# Altium schematic sheet top_level.SchDoc
size 431 x 279 mm; SheetNumber: 1; SheetTotal: 2; ENG_APP_DATE: --/--/--; DSN_APP_DATE: --/--/--; CHK_APP_DATE: --/--/--
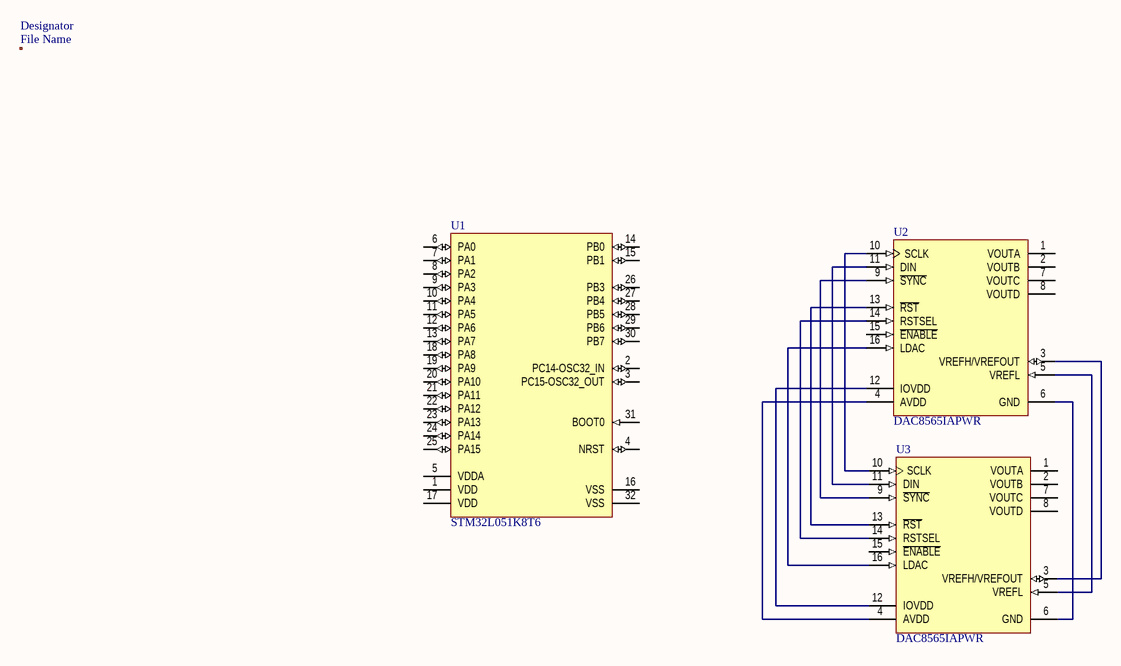
[diagram p0: top_level.SchDoc]

## Parts
U1  STM32L051K8T6  [STM-LQFP32_L]
U2  DAC8565IAPWR  [TI-PW16_L]
U3  DAC8565IAPWR  [TI-PW16_L]

## Sub-sheets
Designator = File Name: no entries

## Nets
NetU2_3: U2.3(VREFH/VREFOUT) U3.3(VREFH/VREFOUT)
NetU2_4: U2.4(AVDD) U3.4(AVDD)
NetU2_5: U2.5(VREFL) U3.5(VREFL)
NetU2_6: U2.6(GND) U3.6(GND)
NetU2_9: U2.9(~{SYNC}) U3.9(~{SYNC})
NetU2_10: U2.10(SCLK) U3.10(SCLK)
NetU2_11: U2.11(DIN) U3.11(DIN)
NetU2_12: U2.12(IOVDD) U3.12(IOVDD)
NetU2_13: U2.13(~{RST}) U3.13(~{RST})
NetU2_14: U2.14(RSTSEL) U3.14(RSTSEL)
NetU2_16: U2.16(LDAC) U3.16(LDAC)

Not connected (* = marked no-connect by the designer): U1 1(VDD) 2(PC14-OSC32_IN) 3(PC15-OSC32_OUT) 4(NRST) 5(VDDA) 6(PA0) 7(PA1) 8(PA2) 9(PA3) 10(PA4) 11(PA5) 12(PA6) 13(PA7) 14(PB0) 15(PB1) 16(VSS) 17(VDD) 18(PA8) 19(PA9) 20(PA10) 21(PA11) 22(PA12) 23(PA13) 24(PA14) 25(PA15) 26(PB3) 27(PB4) 28(PB5) 29(PB6) 30(PB7) 31(BOOT0) 32(VSS); U2 1(VOUTA) 2(VOUTB) 7(VOUTC) 8(VOUTD) 15(~{ENABLE}); U3 1(VOUTA) 2(VOUTB) 7(VOUTC) 8(VOUTD) 15(~{ENABLE})

## Notes on the sheet
- 8
- 7
- 6
- 5
- 4
- 3
- DWG. NO.
- REV.
- SHT.
- 2
- 1
- THIS DOCUMENT AND THE DATA DISCLOSED HEREIN OR HEREWITH IS THE PROPERTY OF ALTIUM LIMITED AND MAY BE FREELY DISTRIBUTED IN WHOLE. NO RIGHTS ARE RESERVED OR EXPRESS OR IMPLIED WARANTEE GIVEN.
- REVISION
- DESCRIPTION
- DATE
- APPROVED
- F
- E
- D
- C
- B
- ENG:
- APPROVALS
- PROJECT
- SUITE 200
- 2175 SALK AVENUE
- CARLSBAD, CA 92008
- A
- DSN:
- CHK:
- REFERENCE DOCUMENTS
- PROJECT REVISION:
- TITLE
- DOCUMENT REVISION:
- DESIGN ITEM:
- USA
- BOM:
- FAB DWG:
- PCB DWG:
- ASSY DWG:
- SCALE:
- SIZE
- CAGE CODE
- FILE NAME
- DWG NO.
- SHEET
- OF
- REV

## Library data of the parts
U1 = CMP-1546-00001-1: Ultra-Low-Power ARM Cortex-M0+ MCU, 64 KB Flash, 1.8 to 3.6 V, -40 to 85 degC, 32-Pin LQFP, RoHS, Tray; VDD Min: 1.8 V; VDD Max: 3.6 V; Flash: 64 KB; RAM: 8 KB; Data EEPROM: 2 KB; Packing: Tray; Mounting Technology: Surface Mount; ComponentLink2URL: http://www.st.com/st-web-ui/static/active/en/resource/technical/document/datasheet/DM00108219.pdf; RoHS: TRUE; PackageDescription: 32-Pin Low-Profile Quad Flat Package, Body 7 x 7 mm, Pitch 0.8 mm; Temperature Max: 85 degC; ComponentLink3URL: http://www.st.com/st-web-ui/static/active/en/resource/technical/document/datasheet/DM00108219.pdf; ComponentLink1URL: http://www.st.com/web/en/home.html; DatasheetVersion: Rev. 4; Temperature Min: -40 degC; ComponentLink2Description: Datasheet; ComponentLink3Description: Package Specification; ComponentLink1Description: Manufacturer URL; PartNumber: STM32L051K8T6
U2 U3 = CMP-0004-01139-1: 16-Bit, Quad Channel, Ultra-Low Glitch, Voltage Output DAC with 2.5 V, 2 ppm/degC Internal Reference, -40 to 105 degC, 16-pin SOP (PW16), Green (RoHS & no Sb/Br); Manufacturer: Texas Instruments; DAC Channels: 4; Power Consumption(Typ)(mW): 3.6; Settling Time(us): 8; DNL(Max)(+/-LSB): 1; SNR(dB): 90; Resolution(Bits): 16; SFDR(dB): 78; Interface: Serial SPI; SubFamily: Precision DAC (=<10MSPS); INL(Max)(+/-LSB): 12; ComponentLink3Description: Package Specification; PackageDescription: 16-Pin Plastic Small Outline, Body 5 x 4.4 mm, Pitch 0.65 mm; Mounting Technology: Surface Mount; PartNumber: DAC8565IAPWR; Code_JEDEC: MO-153; ComponentLink2URL: http://www.ti.com/general/docs/lit/getliterature.tsp?genericPartNumber=DAC8565&fileType=pdf; PackageVersion: 4040064-4/G, 02/2011; ComponentLink1Description: Manufacturer URL; Eco-Plan: Green (RoHS & no Sb/Br); DatasheetVersion: SBAS411C; ComponentLink2Description: Datasheet; PackageReference: PW16; ComponentLink3URL: http://www.ti.com/lit/ml/mpds361/mpds361.pdf; ComponentLink1URL: http://www.ti.com/